# Altium schematic sheet BOOT_JTAG_AUX.SchDoc: =project_title
size Tabloid; CompanyName: Luxonis Holding; Organization: Luxonis Holding; Address1: 1925 Harmony Park Drive; Address2: Westminster, CO; Address3: 80234; Address4: United States; SheetNumber: 9; SheetTotal: 12
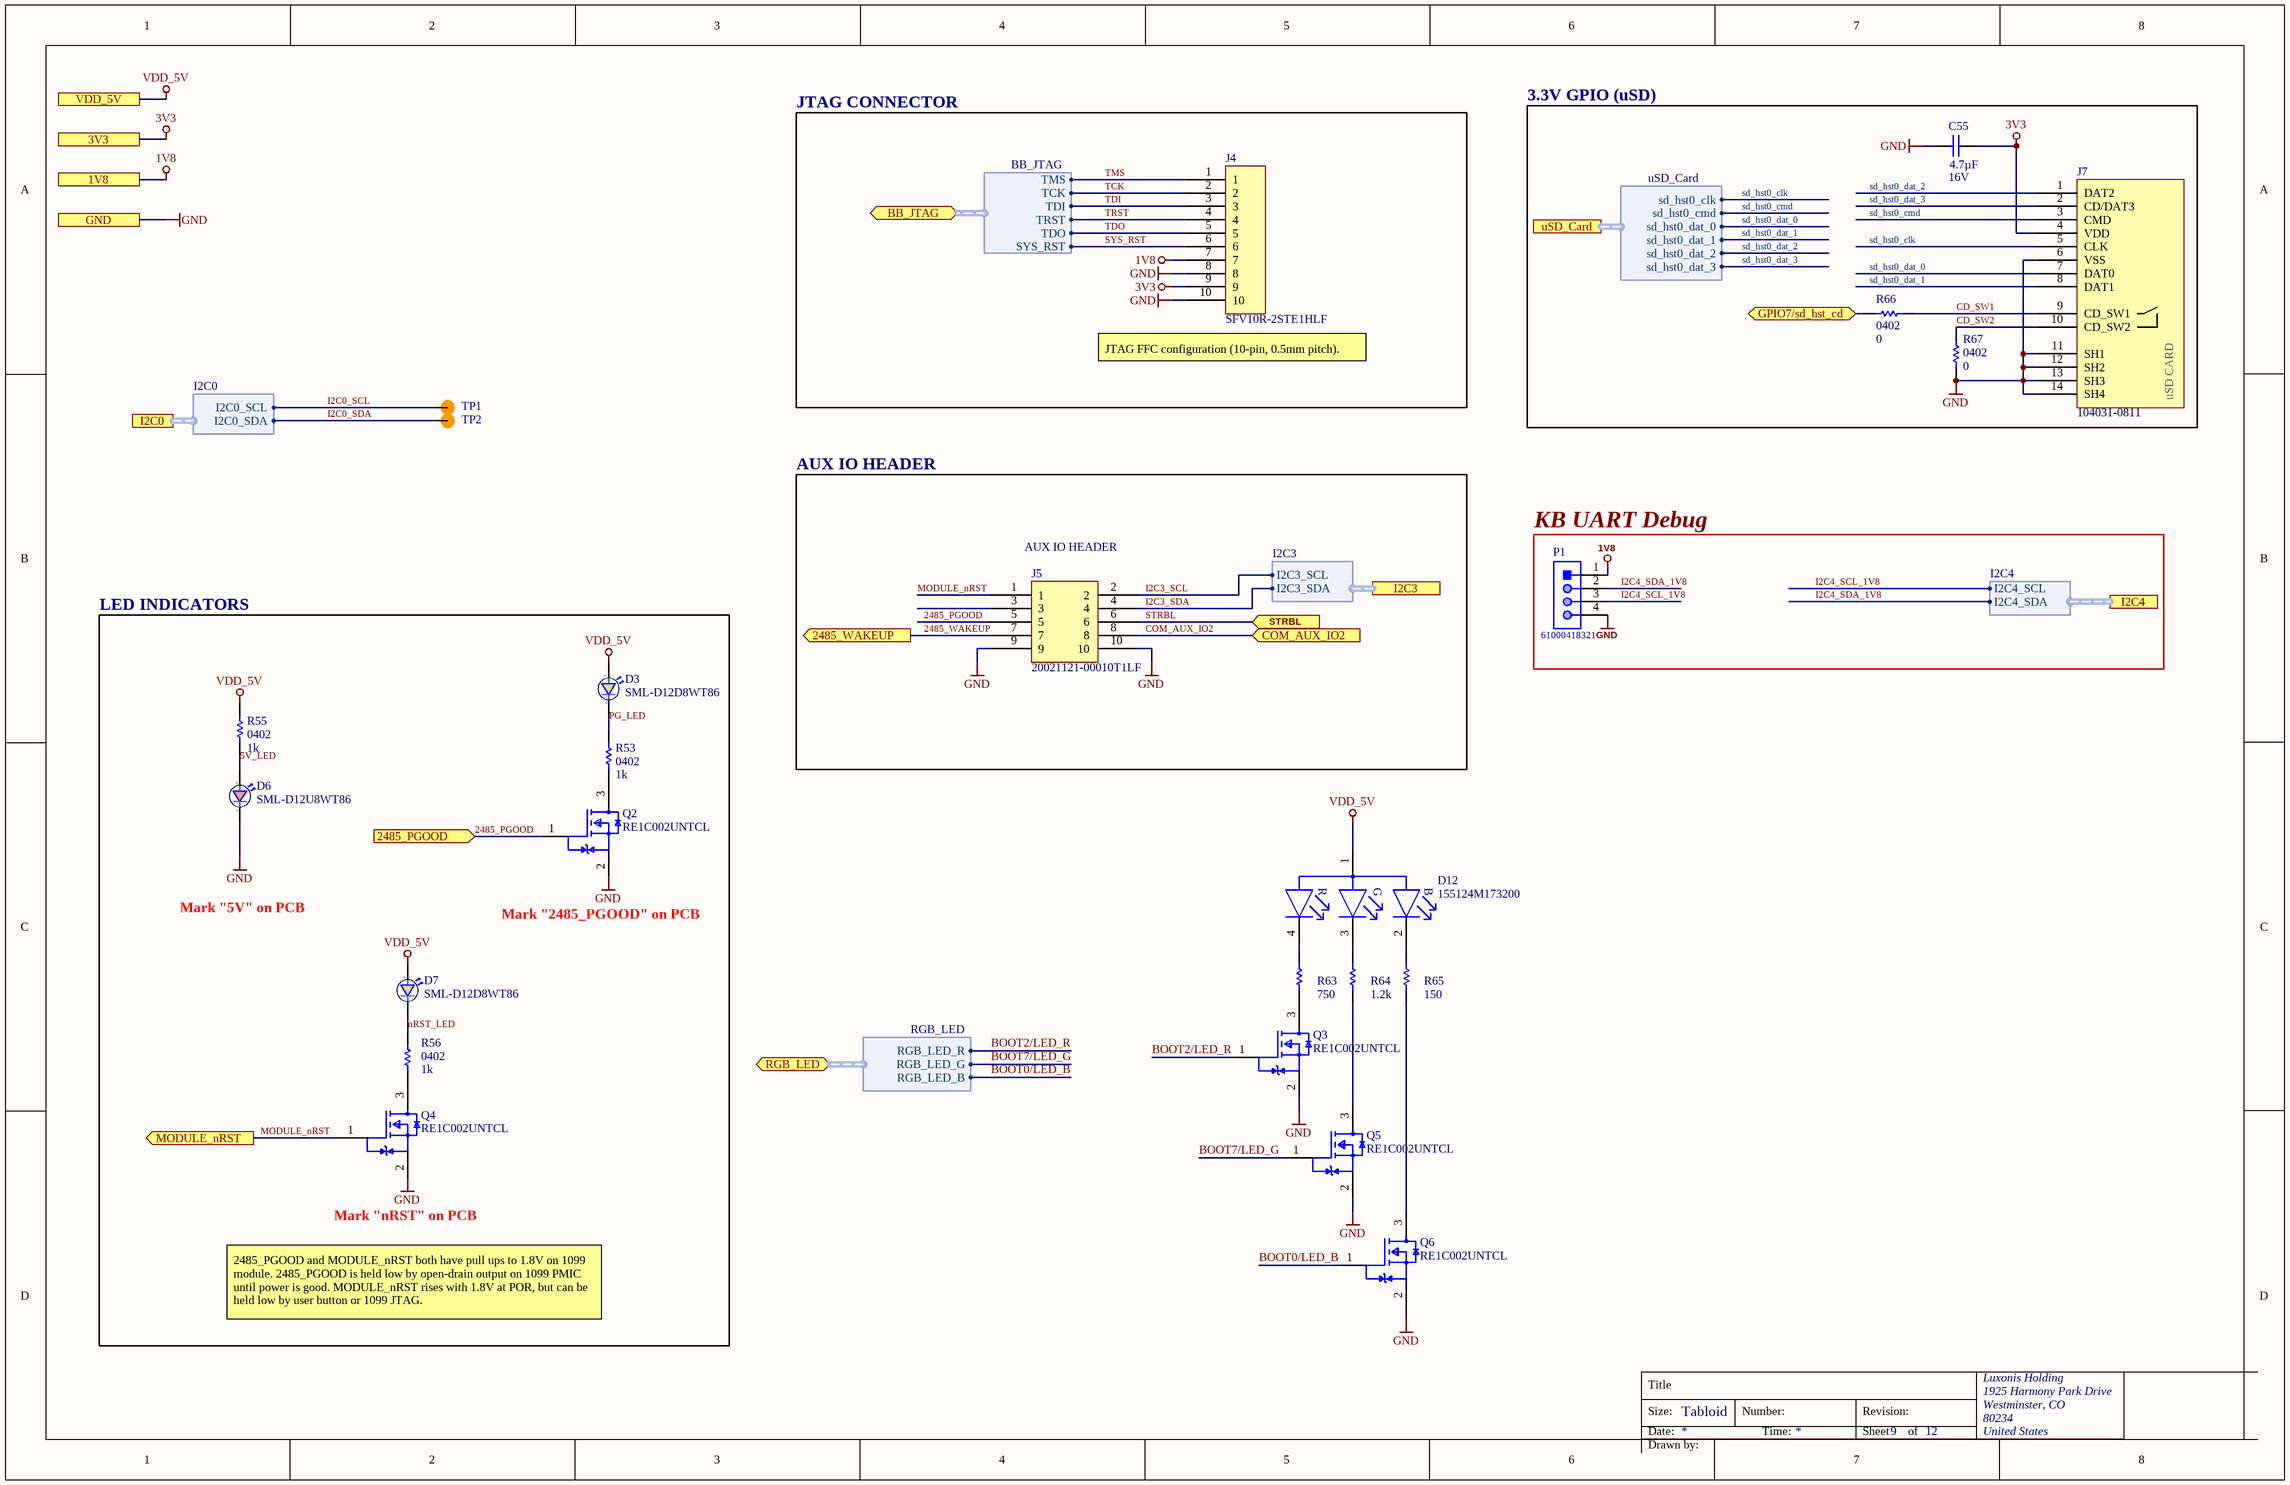
[diagram p0: BOOT_JTAG_AUX.SchDoc]

## Parts
C55  value 4.7µF  Voltage Rating: 16V  [CAPC0603(1608)100_N]  (hidden comment: GRM188R61C475KAAJD)
D3  SML-D12D8WT86  [SML_D1xx8W]
D6  SML-D12U8WT86  [SML_D1xx8W]
D7  SML-D12D8WT86  [SML_D1xx8W]
D12  155124M173200  [FP-155124M173200-MFG]
J4  SFV10R-2STE1HLF  [SFV10R-2STE1HLF]
J5  20021121-00010T1LF  [20021121-00010T1LF]
J7  104031-0811  [104031-0811]
P1  61000418321  [61000418321]
Q2  RE1C002UNTCL  [RE1C002UNTCL]
Q3  RE1C002UNTCL  [RE1C002UNTCL]
Q4  RE1C002UNTCL  [RE1C002UNTCL]
Q5  RE1C002UNTCL  [RE1C002UNTCL]
Q6  RE1C002UNTCL  [RE1C002UNTCL]
R53  value 1k  Case/Package: 0402  [RESC0402(1005)_N]  (hidden comment: RC0402FR-071KL)
R55  value 1k  Case/Package: 0402  [RESC0402(1005)_N]  (hidden comment: RC0402FR-071KL)
R56  value 1k  Case/Package: 0402  [RESC0402(1005)_N]  (hidden comment: RC0402FR-071KL)
R63  value 750  [RESC1005X40X25NL05T05]  (hidden comment: ERJ-2RKF7500X)
R64  value 1.2k  [RESC1005X40X25NL05T05]  (hidden comment: CRCW04021K20FKED)
R65  value 150  [RESC1005X40X25NL05T10]  (hidden comment: RC0402FR-07150RL)
R66  value 0  Case/Package: 0402  [RESC0402(1005)_N]  (hidden comment: CRCW04020000Z0ED)
R67  value 0  Case/Package: 0402  [RESC0402(1005)_N]  (hidden comment: CRCW04020000Z0ED)
TP1  TEST_POINT  [TP100_200_NS]  (value not drawn)  (no BOM)
TP2  TEST_POINT  [TP100_200_NS]  (value not drawn)  (no BOM)

## Blocks framed on the sheet
JTAG CONNECTOR: J4
3.3V GPIO (uSD): C55 J7 R66 R67
AUX IO HEADER: J5
KB UART Debug: P1
LED INDICATORS: D3 D6 D7 Q2 Q4 R53 R55 R56

## Ports
1V8, 3V3, 2485_PGOOD (in), 2485_WAKEUP (out), BB_JTAG (bidir, harness BB_JTAG), COM_AUX_IO2 (in), GND, GPIO7/sd_hst_cd (bidir), I2C0 (harness I2C0), I2C3 (harness I2C3), I2C4 (harness I2C4), MODULE_nRST (out), RGB_LED (bidir, harness RGB_LED), STRBL (in), uSD_Card (harness uSD_Card), VDD_5V

## Harnesses
BB_JTAG: TMS, TCK, TDI, TRST, TDO, SYS_RST
I2C3: I2C3_SDA, I2C3_SCL
uSD_Card: sd_hst0_clk, sd_hst0_cmd, sd_hst0_dat_0, sd_hst0_dat_1, sd_hst0_dat_2, sd_hst0_dat_3
I2C0: I2C0_SDA, I2C0_SCL
RGB_LED: RGB_LED_G, RGB_LED_B, RGB_LED_R
I2C4: I2C4_SDA, I2C4_SCL

## Nets
1V8: J4.7 P1.1 ; port 1V8
3V3: C55.2 J4.9 J7.4(VDD) ; port 3V3
GND: C55.1 D6.1(C) J4.8 J4.10 J5.9 J5.10 J7.6(VSS) J7.11(SH1) J7.12(SH2) J7.13(SH3) J7.14(SH4) P1.4 Q2.2(Source) Q3.2(Source) Q4.2(Source) Q5.2(Source) Q6.2(Source) R67.1 ; port GND
VDD_5V: D3.2(A) D7.2(A) D12.1(COMMON_ANODE) R55.2 ; port VDD_5V
5V_LED: D6.2(A) R55.1
2485_PGOOD: J5.5 Q2.1(Gate) ; port 2485_PGOOD
2485_WAKEUP: J5.7 ; port 2485_WAKEUP
BOOT0/LED_B: Q6.1(Gate) ; port RGB_LED.RGB_LED_B
BOOT2/LED_R: Q3.1(Gate) ; port RGB_LED.RGB_LED_R
BOOT7/LED_G: Q5.1(Gate) ; port RGB_LED.RGB_LED_G
CD_SW1: J7.9(CD_SW1) R66.1
CD_SW2: J7.10(CD_SW2) R67.2
COM_AUX_IO2: J5.8 ; port COM_AUX_IO2
GPIO7/sd_hst_cd: R66.2 ; port GPIO7/sd_hst_cd
I2C0_SCL: TP1.1 ; port I2C0.I2C0_SCL
I2C0_SDA: TP2.1 ; port I2C0.I2C0_SDA
I2C3_SCL: J5.2 ; port I2C3.I2C3_SCL
I2C3_SDA: J5.4 ; port I2C3.I2C3_SDA
I2C4_SCL_1V8: P1.3 ; port I2C4.I2C4_SCL
I2C4_SDA_1V8: P1.2 ; port I2C4.I2C4_SDA
MODULE_nRST: J5.1 Q4.1(Gate) ; port MODULE_nRST
nRST_LED: D7.1(C) R56.2
PG_LED: D3.1(C) R53.2
sd_hst0_clk: J7.5(CLK) ; port uSD_Card.sd_hst0_clk
sd_hst0_cmd: J7.3(CMD) ; port uSD_Card.sd_hst0_cmd
sd_hst0_dat_0: J7.7(DAT0) ; port uSD_Card.sd_hst0_dat_0
sd_hst0_dat_1: J7.8(DAT1) ; port uSD_Card.sd_hst0_dat_1
sd_hst0_dat_2: J7.1(DAT2) ; port uSD_Card.sd_hst0_dat_2
sd_hst0_dat_3: J7.2(CD/DAT3) ; port uSD_Card.sd_hst0_dat_3
STRBL: J5.6 ; port STRBL
SYS_RST: J4.6 ; port BB_JTAG.SYS_RST
TCK: J4.2 ; port BB_JTAG.TCK
TDI: J4.3 ; port BB_JTAG.TDI
TDO: J4.5 ; port BB_JTAG.TDO
TMS: J4.1 ; port BB_JTAG.TMS
TRST: J4.4 ; port BB_JTAG.TRST
NetD12_2: D12.2(BLUE_C) R65.2
NetD12_3: D12.3(GREEN_C) R64.2
NetD12_4: D12.4(RED_C) R63.2
NetQ2_3: Q2.3(Drain) R53.1
NetQ3_3: Q3.3(Drain) R63.1
NetQ4_3: Q4.3(Drain) R56.1
NetQ5_3: Q5.3(Drain) R64.1
NetQ6_3: Q6.3(Drain) R65.1

Not connected (* = marked no-connect by the designer): J5 3

## Notes on the sheet
- (near J4) JTAG FFC configuration (10-pin, 0.5mm pitch).
- (near J5) AUX IO HEADER
- Mark "5V" on PCB
- Mark "2485_PGOOD" on PCB
- Mark "nRST" on PCB
- 2485_PGOOD and MODULE_nRST both have pull ups to 1.8V on 1099 module. 2485_PGOOD is held low by open-drain output on 1099 PMIC until power is good. MODULE_nRST rises with 1.8V at POR, but can be held low by user button or 1099 JTAG.
- Title
- Size:
- Date:
- Tabloid
- Number:
- Time:
- Revision:
- Sheet
- of
- Drawn by:
- (in symbol CMP-005-000008-2) uSD CARD
- (in symbol CMP-007-00038-2) R; G; B

## Library data of the parts
C55 = CMP-004-000020-4: CAP CER 4.7UF 16V X5R 0603 10%; Manufacturer 1: Murata; Manufacturer Part Number 1: GRM188R61C475KAAJD; Case/Package: 0603; Min Operating Temperature: -55°C; Max Operating Temperature: 85°C; Tolerance: 10%; Dielectric: X5R; Length: 1.6mm; Height: 0.8mm; Width: 0.8mm; Depth: 0.8mm; ComponentLink1URL: https://datasheet.ciiva.com/14813/595grm188r61c475kaaj23-14813668.pdf?src-supplier=Arrow; ComponentLink1Description: https://datasheet.ciiva.com/14813/595grm188r61c475kaaj23-14813668.pdf?src-supplier=Arrow; Manufacturer 2: Murata; Manufacturer Part Number 2: GRM188R61C475KAAJD; Manufacturer 3: Murata; Manufacturer Part Number 3: GRM188R61C475KAAJD; Design Item ID: GRM188R61C475KAAJD; Mounting Technology: SMT
D3 D7 = CMP-111-000003-2: LED ORANGE DIFFUSED 0603 SMD Orange 605nm LED Indication - Discrete 2.2V 0603 (1608 Metric); Manufacturer 1: Rohm; Forward Current: 20mA; Case/Package: 0603; Color: Orange; Min Operating Temperature: -40°C; Max Operating Temperature: 85°C; Forward Voltage: 2.2V; Manufacturer Part Number 1: SML-D12D8WT86
D6 = CMP-111-000005-2: LED RED DIFFUSED 0603 SMD Red 620nm LED Indication - Discrete 2.2V 0603 (1608 Metric); Manufacturer 1: Rohm; Forward Current: 20mA; Case/Package: 0603; Color: Red; Min Operating Temperature: -40°C; Max Operating Temperature: 85°C; Forward Voltage: 2.2V; Manufacturer Part Number 1: SML-D12U8WT86
D12 = CMP-007-00038-2: Triple Color LED; Manufacturer 1: Wurth Elektronik; Max Current Rating: 30mA; Viewing Angle: 120°; Colour: RGB; Forward Current: 20mA; Case/Package: 1204; Manufacturer Part Number 1: 155124M173200
J4 = CMP-005-000024-3: CONN FFC TOP 10POS 0.50MM R/A; Manufacturer 1: Amphenol FCI; Voltage Rating: 50V; Gender: Female; Pitch: 0.5mm; Manufacturer Part Number 1: SFV10R-2STE1HLF; Mount: Surface Mount; Min Operating Temperature: -55°C; Max Operating Temperature: 105°C; Orientation: Right Angle; Pins: 10
J5 = CMP-005-000031-2: CONN HEADER SMD 10POS 1.27MM; Manufacturer 1: Amphenol FCI; Number of Contacts: 10; Contact Resistance: 30mR; Max Voltage Rating (AC): 125V; Connector Type: Male Pin; Row Spacing: 0.05inch; Manufacturer Part Number 1: 20021121-00010T1LF; Stock 1: 1465; Pricing 1: 1=0.77000, 10=0.71800, 100=0.55040, 500=0.47860, 1000=0.39485, 5000=0.34699, 10000=0.32306 (USD); RoHS: Yes; Mount: Surface Mount; Contact Plating: Gold; Color: Black; Contact Material: Copper Alloy; Housing Color: Black; Housing Material: Thermoplastic; Min Operating Temperature: -40°C; Max Operating Temperature: 85°C; Number of Rows: 2; Termination: Solder; Package Quantity: 93; Packaging: Rail/Tube; Number of Positions: 10; Orientation: Straight; Length: 6.35mm; Pitch: 1.27mm; Contact Mating Length: 0.12inch; Depth: 3.4mm; ComponentLink1URL: https://datasheet.ciiva.com/18659/20021121-18659066.pdf?src-supplier=Digi-Key; ComponentLink1Description: https://datasheet.ciiva.com/18659/20021121-18659066.pdf?src-supplier=Digi-Key; ComponentLink2URL: https://datasheet.ciiva.com/10033/20021121-10033582.pdf?src-supplier=Avnet; ComponentLink2Description: https://datasheet.ciiva.com/10033/20021121-10033582.pdf?src-supplier=Avnet; Design Item ID: 20021121-00010T1LF; Pins: 10; Source: LuxonisMaster.SchLib
J7 = CMP-005-000008-2: CONN MICRO SD CARD PUSH-PULL R/A; Manufacturer 1: Molex; Manufacturer Part Number 1: 104031-0811; Pins: 9
P1 = CMP-002-00148-1: Terminal and Terminal Block; Manufacturer 1: Wurth Elektronik; Connector Type: BOARD CONNECTOR; Pins: 4; Min Operating Temperature: -40°C; Manufacturer Part Number 1: 61000418321; Mounting Technology: Board; Max Operating Temperature: 125°C
Q2-Q6 = CMP-120-000001-2: MOSFET N-CH 20V 0.2A EMT3; Manufacturer 1: Rohm; Continuous Drain Current: 200mA; Case/Package: SOT-89; Manufacturer Part Number 1: RE1C002UNTCL; Design Item ID: RE1C002UNTCL; Max Drain to Source Voltage: 20V
R53 R55 R56 = CMP-013-000004-10: RES SMD 1K OHM 1% 1/16W 0402; Manufacturer 1: Yageo; Power Rating: 62.5mW; Voltage Rating: 50V; Min Operating Temperature: -55°C; Max Operating Temperature: 155°C; Manufacturer Part Number 1: RC0402FR-071KL; Tolerance: 1%; Design Item ID: RC0402FR-071KL
R63 = CMP-009-00197-7: RES SMD 750 OHM 1% 0.1W 0402; Manufacturer 1: Panasonic; Power Rating: 100mW; Manufacturer Part Number 1: ERJ-2RKF7500X; Case/Package: 0402; Tolerance: 1%
R64 = CMP-009-00198-14: RES SMD 1.2K OHM 1% 0.063W 0402; Manufacturer 1: Vishay; Voltage Rating: 50V; Power Rating: 63mW; Case/Package: 0402; Manufacturer Part Number 1: CRCW04021K20FKED; Tolerance: 1%
R65 = CMP-009-00196-7: RES SMD 150 OHM 1% 1/16W 0402; Manufacturer 1: Yageo; Voltage Rating: 50V; Case/Package: 0402; Tolerance: 1%; Manufacturer Part Number 1: RC0402FR-07150RL
R66 R67 = CMP-013-000022-11: RES SMD 0 OHM 5% 1/16W 0402; Manufacturer 1: Vishay; Power Rating: 63mW; Voltage Rating: 50V; Manufacturer Part Number 1: CRCW04020000Z0ED; Min Operating Temperature: -55°C; Max Operating Temperature: 155°C; Tolerance: 5%; Design Item ID: CRCW04020000Z0ED
TP1 TP2 = CMP-015-000000-2: Manufacturer Part Number 1: /; Design Item ID: TEST_POINT; Source: LuxonisMaster.SchLib